# EAGLE design synth-zodiac-libra-vca (EAGLE 9.6.2)
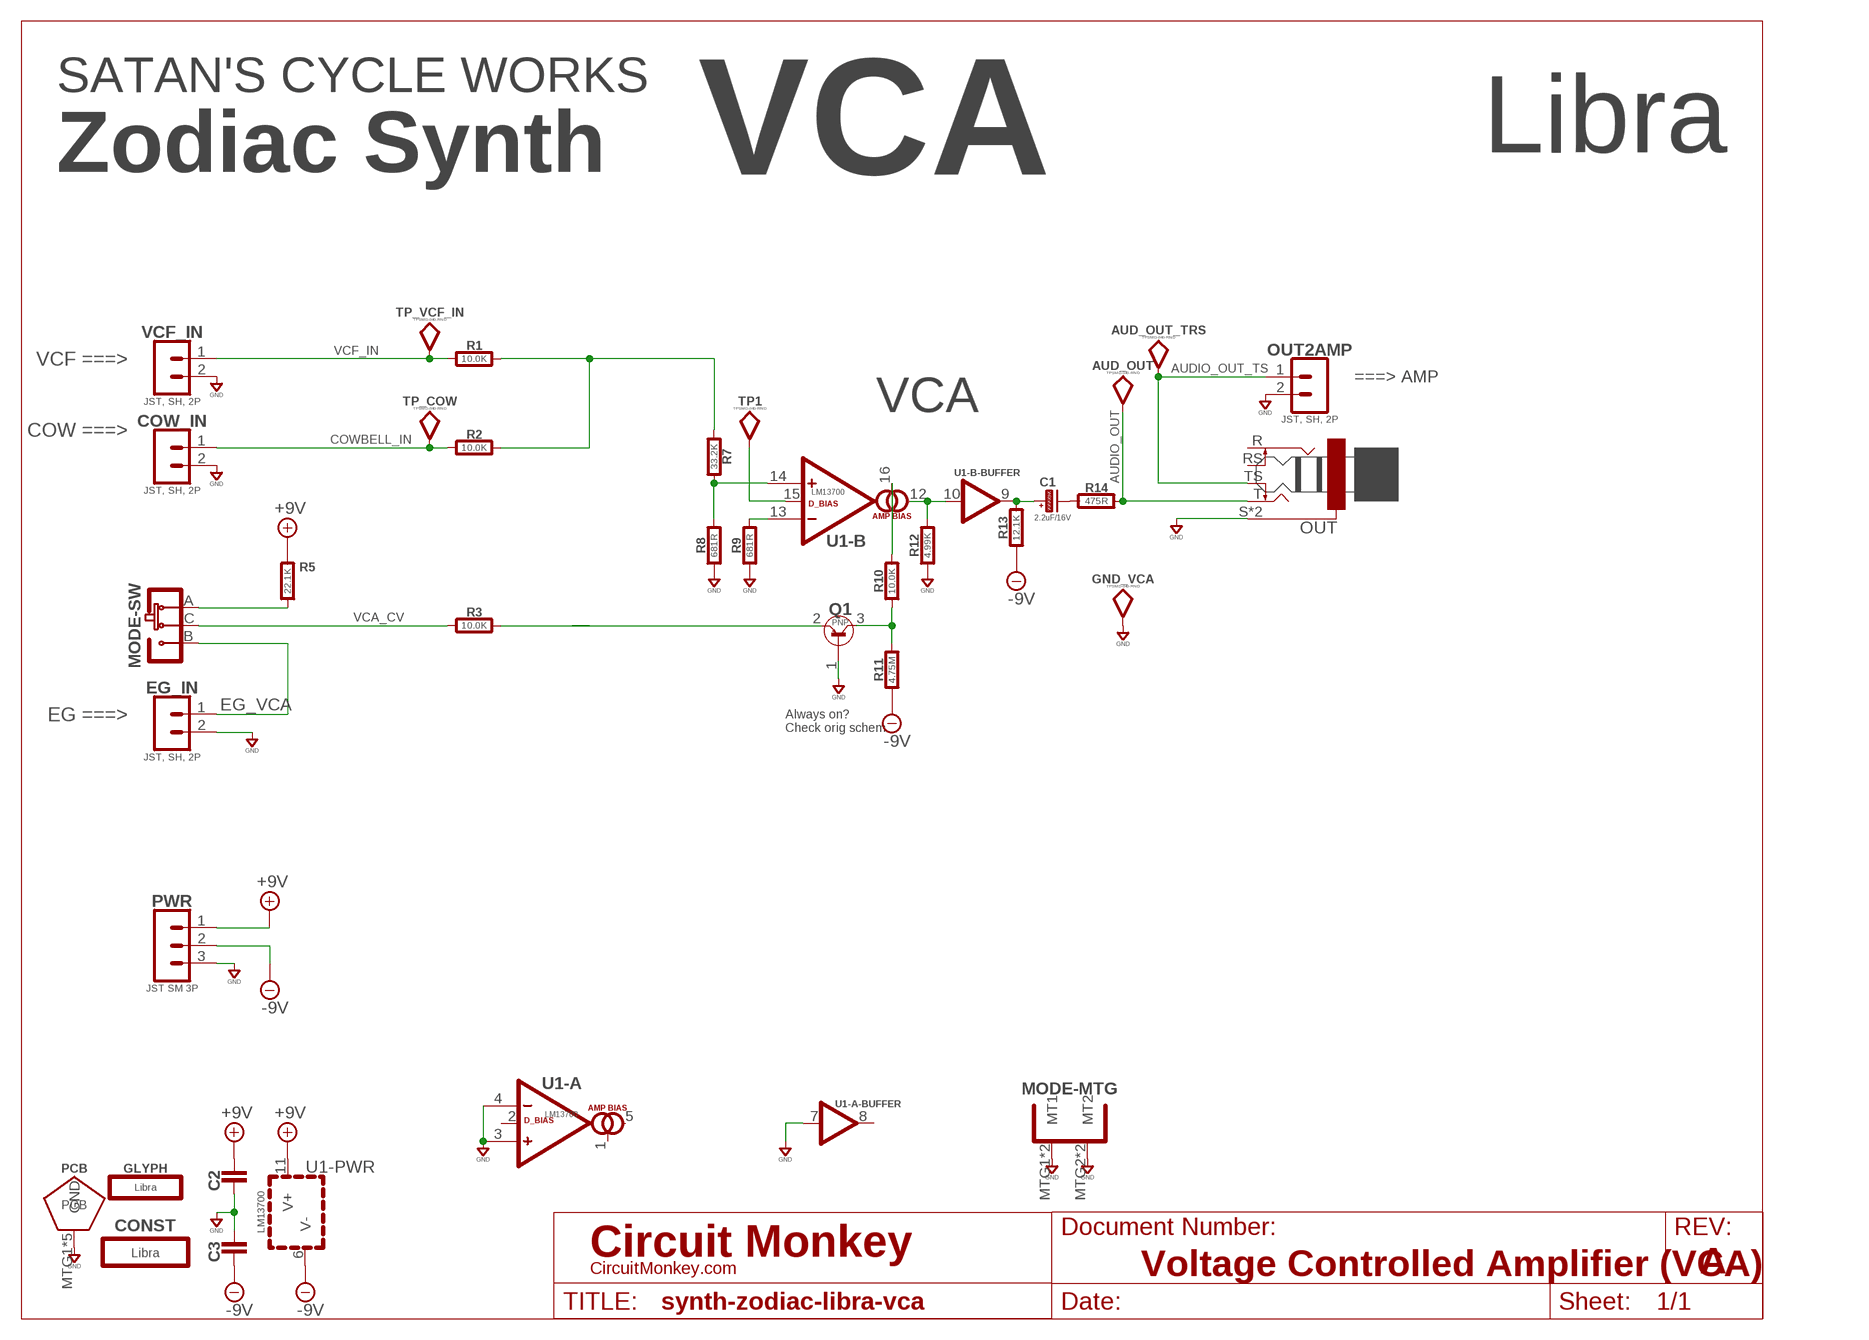
[diagram p0: schematic, sheet 1]
U$1 (LETTER_L-CIRCUITMONKEY): DOCUMENT_NUMBER: Voltage Controlled Amplifier (VCA); REV: A

## Parts
AUD_OUT  TPSMD-040-RND  [SMD-040MIL-RND]
AUD_OUT_TRS  TPSMD-040-RND  [SMD-040MIL-RND]
C1  2.2uF/16V  CAPACITOR_POL-ALUM-SMT-4  [CAP_ALUM_SMT_4]
C2  0.1uF  CAPACITOR0603  [0603-CAP]
C3  0.1uF  CAPACITOR0603  [0603-CAP]
CONST  Libra  CONSTELLATION-LIBRA  [LIBRA-CONST]
COW_IN  JST, SH, 2P  02P-SM-VT-SMT  [BM02B-SRSS-TB]
EG_IN  JST, SH, 2P  02P-SM-VT-SMT  [BM02B-SRSS-TB]
GLYPH  Libra  GLYPH-LIBRA  [LIBRA-GLYPH]
GND_VCA  TPSMD-040-RND  [SMD-040MIL-RND]
MODE  SLIDE-SPDT-MNTSS-12-F45-TH-PCB-2  [SS-12-F45-PNL-SMT-2]
OUT  6.35MM JACK  TRS-JACK-STEREOPCB-PANEL  [PNL-6.35-SMT-PADS]
OUT2AMP  JST, SH, 2P  02P-SM-VT-SMT  [BM02B-SRSS-TB]
PCB  PCB FAB  PENTAGON-40R  [PENTAGON-40MM-RAD]
PWR  JST SM 3P  03P-SM-VT-SMT  [BM03B-SRSS-TB]
Q1  PNP  PNP-BC856  [SOT-23]
R1  10.0K  RESISTOR0603  [0603-RES]
R2  10.0K  RESISTOR0603  [0603-RES]
R3  10.0K  RESISTOR0603  [0603-RES]
R5  22.1K  RESISTOR0603  [0603-RES]
R7  33.2K  RESISTOR0603  [0603-RES]
R8  681R  RESISTOR0603  [0603-RES]
R9  681R  RESISTOR0603  [0603-RES]
R10  10.0K  RESISTOR0603  [0603-RES]
R11  4.75M  RESISTOR0603  [0603-RES]
R12  4.99K  RESISTOR0603  [0603-RES]
R13  12.1K  RESISTOR0603  [0603-RES]
R14  475R  RESISTOR0603  [0603-RES]
TP1  TPSMD-040-RND  [SMD-040MIL-RND]
TP_COW  TPSMD-040-RND  [SMD-040MIL-RND]
TP_VCF_IN  TPSMD-040-RND  [SMD-040MIL-RND]
U1  LM13700  DUAL-BIASLM13700-SMD  [SO16]
VCF_IN  JST, SH, 2P  02P-SM-VT-SMT  [BM02B-SRSS-TB]

## Nets
+9V: C2.2 PWR.1 R5.2 U1.11(-PWR:V+)
-9V: C3.1 PWR.2 R11.1 R13.1 U1.6(-PWR:V-)
AUDIO_OUT: AUD_OUT.TP OUT.T R14.2
AUDIO_OUT_TS: AUD_OUT_TRS.TP OUT2AMP.1 OUT.TS(TN)
COWBELL_IN: COW_IN.1 R2.1 TP_COW.TP
EG_VCA: EG_IN.1 MODE.B(-SW:B)
GND: C2.1 C3.2 COW_IN.2 EG_IN.2 GND_VCA.TP MODE.MTG1(-MTG:MT1) MODE.MTG2(-MTG:MT2) MODE.MTG3(-MTG:MT1) MODE.MTG4(-MTG:MT2) OUT2AMP.2 OUT.S OUT.SS(S) PCB.MTG1(GND) PCB.MTG2(GND) PCB.MTG3(GND) PCB.MTG4(GND) PCB.MTG5(GND) PWR.3 Q1.1(BASE) R8.1 R9.1 R12.1 U1.3(-A:+) U1.4(-A:-) U1.7(-A-BUFFER:IN) VCF_IN.2
N$45: R9.2 U1.13(-B:-)
N$60: R7.2 R8.2 U1.14(-B:+)
N$61: TP1.TP U1.15(-B:DIODE-BIAS)
N$62: R12.2 U1.10(-B-BUFFER:IN) U1.12(-B:OUT)
N$63: R10.2 U1.16(-B:AMP-BIAS)
N$64: C1.POS(P) R13.2 U1.9(-B-BUFFER:OUT)
N$65: C1.NEG(N) R14.1
N$66: Q1.3(COLLECTOR) R10.1 R11.2
N$68: Q1.2(EMITTER) R3.2
N$142: MODE.A(-SW:A) R5.1
VCA_CV: MODE.C(-SW:C) R3.1
VCF_IN: R1.1 TP_VCF_IN.TP VCF_IN.1
VCF_OUT: R1.2 R2.2 R7.1
Unconnected: OUT.R OUT.RS(RN) U1.1(-A:AMP-BIAS) U1.2(-A:DIODE-BIAS) U1.5(-A:OUT) U1.8(-A-BUFFER:OUT)

## Notes on the sheet
- VCA | Libra
- SATAN'S CYCLE WORKS
- Zodiac Synth
- VCF ===>
- ===> AMP
- VCA
- COW ===>
- EG ===>
- Always on?  
  Check orig schem.

## Library data of the parts
AUD_OUT AUD_OUT_TRS GND_VCA TP1 TP_COW TP_VCF_IN = con-testpoints:TP: Test Point -- Testpoint
C1 = rlc:CAPACITOR_POL: Polarized Capacitor
C2 C3 = rlc:CAPACITOR: Capacitor; COST01: 0.12; COST10: 0.09; COST100: 0.05
CONST = circuit-monkey-zodiac:CONSTELLATION: Constellations
COW_IN EG_IN OUT2AMP VCF_IN = con-jst:02P: 2 pin connector; COST01: 0.45; COST10: 0.4; COST100: 0.35; MFR: JST; MPN: BMB02B-SRSS-TB
GLYPH = circuit-monkey-zodiac:GLYPH: Glyph
MODE = switch-thd:SLIDE-SPDT-MNT: Slide Switch, SPDT; COST01: 0.15; COST10: 0.12; COST100: 0.12; MFR: Tayda; MPN: A-659/A-5111/A-5104
OUT = con-trs:TRS-JACK-STEREO: TRS Jack
PCB = circuit-monkey-zodiac:PENTAGON: Pentagram shaped PCB
PWR = con-jst:03P: 3 pin connector; COST01: 0.60; COST10: 0.45; COST100: 0.38; MFR: JST; MPN: BM03B-SRSS-TB
Q1 = transistor-bjt:PNP: PNP BJ Transistor; MFR: On Semiconductor; MOUSER: https://www.mouser.com/ProductDetail/ON-Semiconductor/BC856BLT1G; MPN: BC856
R1-R3 R5 R7-R14 = rlc:RESISTOR: Resistor; COST01: 0.10; COST10: 0.05; COST100: 0.02
U1 = op-amp:DUAL-BIAS: Op Amp with Bias controls; COST01: 1.70; COST10: 1.60; COST100: 1.50; MFR: TI; MPN: LM13700M

## Board
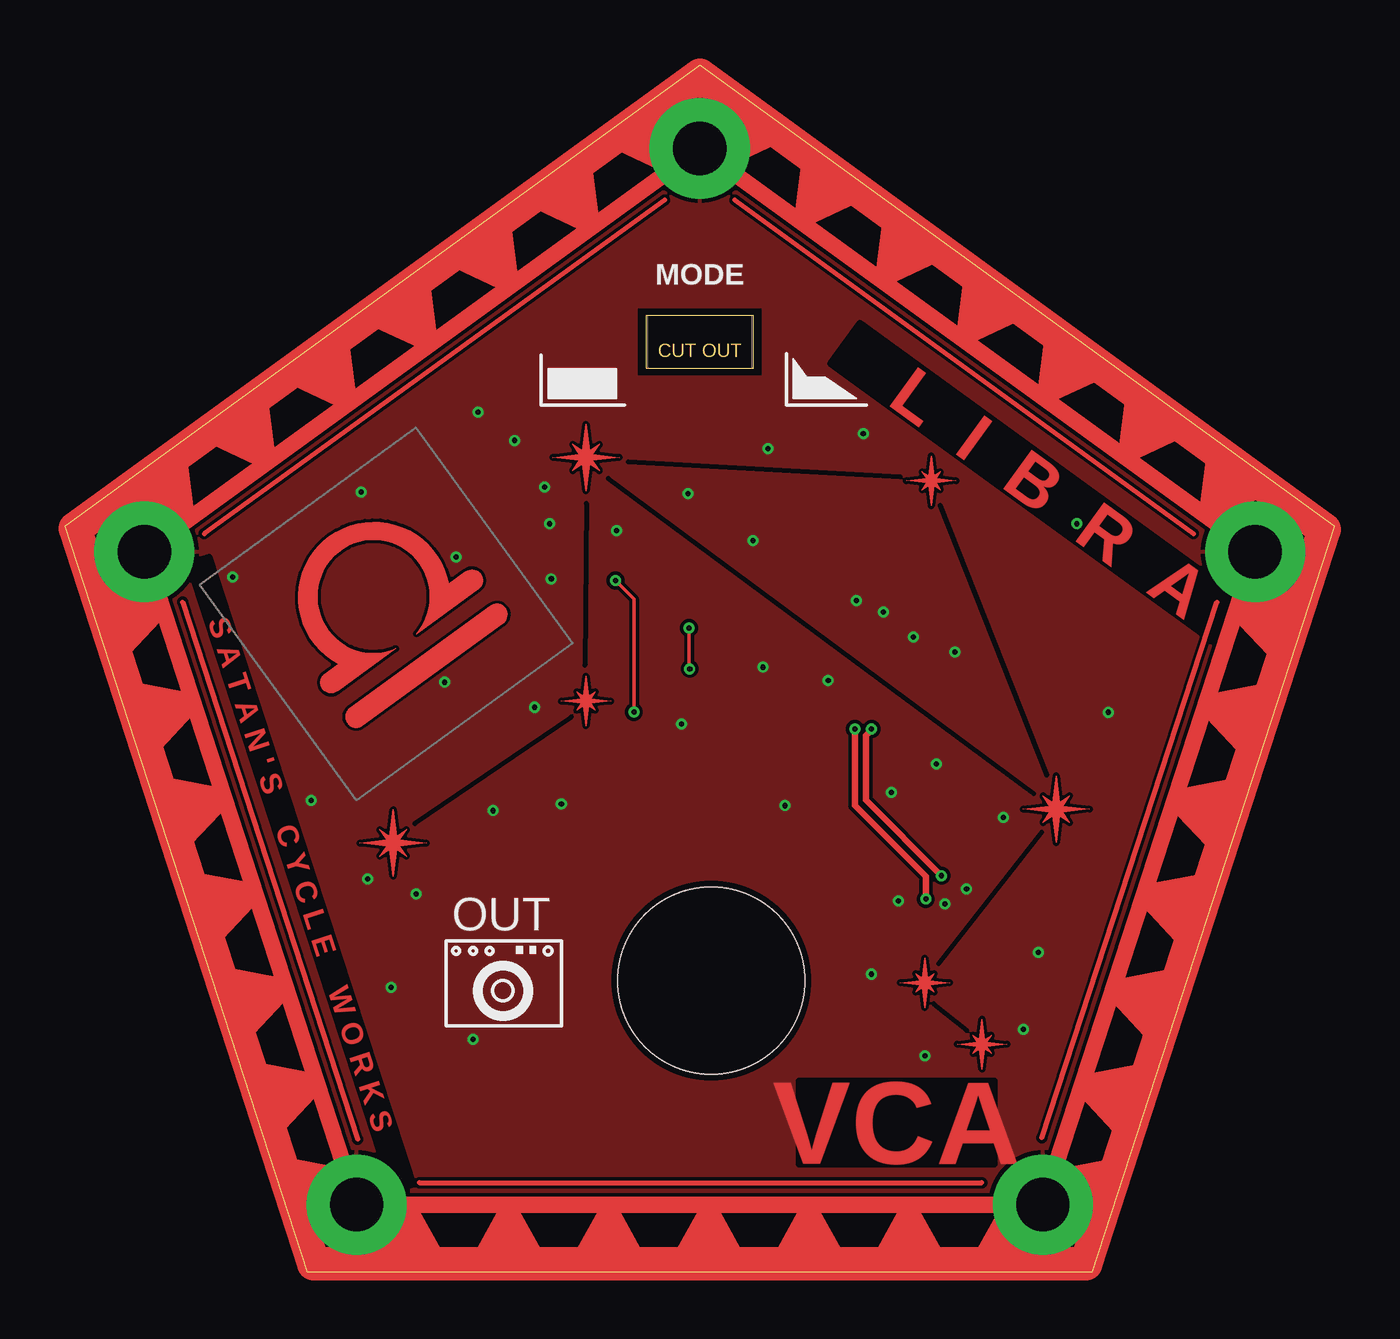
[diagram p1: board, top side]
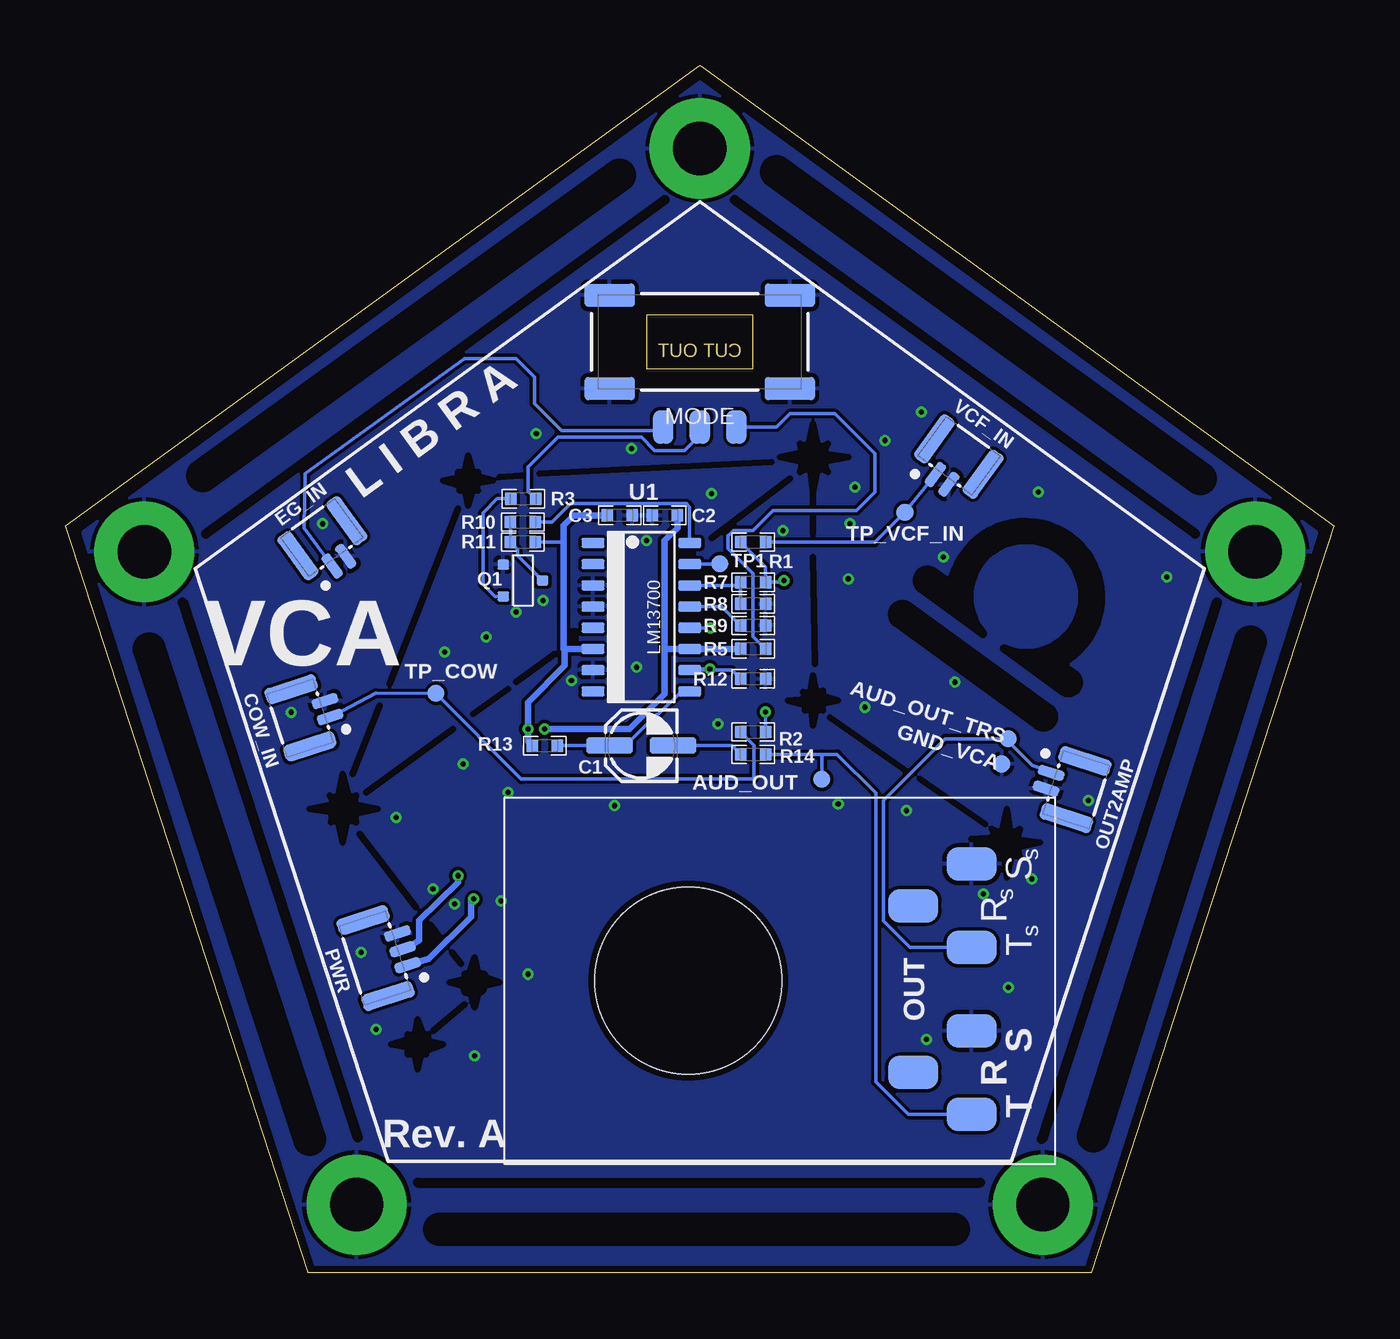
[diagram p2: board, bottom side, seen from below]

Size 76.08 x 72.36 mm. Coordinates in mm from the lower left corner, seen from the top.
Copper layers (1*16): Top 0.0356mm / dielectric 1.5011mm / Bottom 0.0356mm
Design rules "OSH-CircuitMonkey *": minimum track width 6mil, minimum drill 12mil, track to track 0.2mm, track to pad 0.2mm, pad to pad 0.2mm, via to via 0.2mm, smd to smd 0.15mm, copper to edge 15mil, drill to drill 6mil, minimum pad ring 7mil, minimum via ring 7mil, stop-mask expansion 3mil, vias tented up to drill 12mil, thermal gap 10mil
bRestrict: area 53.4,12.2 to 56.5,15.2; area 50,15.9 to 53,18.9; area 57.3,25.8 to 61.4,29.9; area 50.4,46 to 53.4,49; area 29.1,46.8 to 33.2,50.9; area 29.7,32.8 to 32.7,35.8; area 17.6,23.7 to 21.7,27.8; 19 lines

### Footprints (pad centres in the part's own frame; a part is rotated, then mirrored left to right if it is on the bottom)
SMD-040MIL-RND = smd 1.016 x 1.016: TP 0,0
CAP_ALUM_SMT_4 = smd 2.8 x 1: NEG -1.9,0; POS 1.9,0
0603-CAP = smd 0.711 x 0.762: 1 -0.752,0; 2 0.752,0
BM02B-SRSS-TB = smd 0.6 x 1.6: 1 -0.5,-0.3; 2 0.5,-0.3 | smd 1 x 3.2: MTG1 1.8,1.4; MTG2 -1.8,1.4
SS-12-F45-PNL-SMT-2 = smd 1.2 x 2 bottom: A -2.2,-5.1; B 2.2,-5.1; C 0,-5.1 | smd 3 x 1.4 bottom: MTG1 -5.4,2.8; MTG2 5.4,2.8; MTG3 -5.4,-2.8; MTG4 5.4,-2.8
PNL-6.35-SMT-PADS = smd 2 x 3: R -5.5,-13.5; RS 4.5,-13.5; S -3,-17; SS 7,-17; T -8,-17; TS 2,-17 | hole 11.2: 0,0
PENTAGON-40MM-RAD = drill 3.2 pad 6: MTG1 0,35; MTG2 33.3,10.82; MTG3 20.57,-28.32; MTG4 -20.57,-28.32; MTG5 -33.3,10.82
BM03B-SRSS-TB = smd 0.6 x 1.6: 1 -1,-0.3; 2 0,-0.3; 3 1,-0.3 | smd 1 x 3.2: MTG1 2.4,1.4; MTG2 -2.4,1.4
SOT-23 = smd 0.6 x 0.7: 1 -0.95,-1.18; 2 0.95,-1.18; 3 0,1.18
0603-RES = smd 0.711 x 0.762: 1 -0.752,0; 2 0.752,0
SO16 = smd 0.6 x 1.4: 1 -4.445,-2.9; 2 -3.175,-2.9; 3 -1.905,-2.9; 4 -0.635,-2.9; 5 0.635,-2.9; 6 1.905,-2.9; 7 3.175,-2.9; 8 4.445,-2.9; 9 4.445,2.9; 10 3.175,2.9; 11 1.905,2.9; 12 0.635,2.9; 13 -0.635,2.9; 14 -1.905,2.9; 15 -3.175,2.9; 16 -4.445,2.9

### Placement (x,y rotation side)
AUD_OUT  30.72,29.54 180 bottom
AUD_OUT_TRS  19.54,31.96 180 bottom
C1  41.54,31.56 180 bottom
C2  40.14,45.36 0 bottom
C3  42.84,45.36 0 bottom
CONST  42.14,32.96 0 top
COW_IN  60.64,33.66 108 bottom
EG_IN  59.84,42.86 36 bottom
GLYPH  19.24,39.46 36 top
GND_VCA  19.94,30.46 180 bottom
MODE  38.04,55.76 0 top
OUT  38.74,17.46 90 bottom
OUT2AMP  16.84,29.36 252 bottom
PCB  38.04,32.36 0 top
PWR  56.14,19.26 108 bottom
Q1  48.64,41.46 270 bottom
R1  34.84,43.76 180 bottom
R2  34.84,32.38 0 bottom
R3  48.63,46.36 180 bottom
R5  34.84,37.36 180 bottom
R7  34.84,41.36 180 bottom
R8  34.84,40.06 180 bottom
R9  34.84,38.76 180 bottom
R10  48.64,44.96 0 bottom
R11  48.64,43.76 180 bottom
R12  34.84,35.56 180 bottom
R13  47.34,31.56 0 bottom
R14  34.84,31.03 0 bottom
TP1  36.84,42.46 0 bottom
TP_COW  53.86,34.7 180 bottom
TP_VCF_IN  25.74,45.56 180 bottom
U1  41.54,39.26 270 bottom
VCF_IN  23.34,47.76 324 bottom

### Tracks (layer width: path | path; a pad name or v marks a point on that pad's centre or on a via)
+9V  (via drill 0.3)
  Top 0.4: v51.59,22.36 51.59,23.71 47.34,27.96 v47.34,32.56
  Bottom 0.2: R5.2
  Bottom 0.4: R5.2 U1.11 40.14,37.36 | C2.2 39.39,44.61 40.14,43.86 40.14,37.36 | 40.14,37.36 40.14,34.67 42.25,32.56 v47.34,32.56 | v51.59,22.36 51.75,22.21 51.75,21.3 54.3,18.77 PWR.1
-9V  (via drill 0.3)
  Top 0.4: v48.34,32.56 48.34,32.49 48.01,32.16 48.01,28.29 v52.54,23.76
  Bottom 0.2: R11.1 46.19,43.76
  Bottom 0.4: C3.1 45.59,45.36 46.19,44.76 46.19,43.76 46.19,37.36 U1.6 46.15,37.36 46.14,36.36 48.34,34.16 v48.34,32.56 48.34,31.81 R13.1 | v52.54,23.76 52.54,23.36 54.86,21.07 54.87,19.89 55.71,19.35 PWR.2
AUDIO_OUT
  Bottom 0.2: AUD_OUT.TP 30.72,31.03 R14.2 29.81,31.03 27.49,28.71 27.49,11.41 25.54,9.46 OUT.T
AUDIO_OUT_TS
  Bottom 0.2: OUT.TS 25.44,19.46 27.04,21.06 27.04,28.26 23.34,31.96 AUD_OUT_TRS.TP 19.54,31.81 18.09,30.36 16.97,29.99 OUT2AMP.1
COWBELL_IN
  Bottom 0.2: R2.1 34.79,31.58 34.79,29.56 48.74,29.56 53.86,34.68 TP_COW.TP 57.45,34.7 59.99,33.38 59.99,33.37 COW_IN.1
EG_VCA
  Bottom 0.2: EG_IN.1 61.75,44.62 61.7,47.86 52.13,54.76 49.04,54.76 47.94,53.66 47.94,52.06 46.34,50.46 40.44,50.46 MODE.B
GND  (via drill 0.3)
  other vias: 47.44,40.26 29.04,44.86 26.94,49.86 42.14,49.36 47.84,50.26 49.04,39.56 53.34,37.16 56.24,27.26 49.54,28.76 43.14,27.96 45.74,35.46 50.84,38.06 41.84,36.26 41.24,43.86 10.04,41.66 28.14,33.86 29.14,41.56 24.74,51.56 22.74,35.36 29.74,28.06 21.04,22.66 18.14,23.56 14.74,28.26 54.04,22.96 48.34,17.86 51.54,12.96 49.94,22.26 52.24,30.46 33.04,44.46 62.54,33.56 24.44,13.96 19.54,17.06 23.44,42.86 17.74,46.76 25.64,27.66 36.94,32.86 37.34,46.66 60.64,44.86 57.44,14.56 58.34,19.16 52.74,22.06 28.74,47.06
  pour Bottom (rank 5): 15.04,0.36 61.04,0.36 75.04,44.36 38.04,71.36 1.04,44.36
  pour Top (rank 4): 17.34,3.86 58.74,3.86 71.64,43.26 38.04,67.66 4.54,43.26
N$45
  Bottom 0.2: U1.13 36.73,39.9 R9.2
N$60
  Bottom 0.2: U1.14 35.4,41.17 R7.2 R8.2
N$61
  Bottom 0.2: U1.15 36.87,42.44 TP1.TP
N$62  (via drill 0.3)
  Top 0.2: v37.44,36.16 37.4,36.2 v37.4,38.61
  Bottom 0.2: R12.2 36.12,36.09 U1.10 38.57,36.16 v37.44,36.16 | v37.4,38.61 38.62,38.61 U1.12
N$63
  Bottom 0.2: R10.2 46.89,44.96 45.79,46.06 38.84,46.06 38.64,45.86 U1.16
N$64
  Bottom 0.2: U1.9 39.14,34.82 40.54,33.42 40.64,33.42 42.5,31.56 C1.POS R13.2
N$65
  Bottom 0.2: R14.1 36.12,31.56 C1.NEG
N$66
  Bottom 0.2: R10.1 R11.2 48.96,43.33 48.96,42.96 Q1.3
N$68
  Bottom 0.2: R3.2 50.18,46.36 51.04,45.5 51.04,41.23 50.32,40.51 Q1.2
N$142
  Bottom 0.2: R5.1 34.11,37.36 34.85,38.1 34.85,41.86 36.34,43.36 36.34,44.16 36.31,44.16 36.03,44.44 34.86,44.44 33.64,45.66 28.64,45.66 27.54,46.76 27.54,49.06 29.94,51.46 32.64,51.46 33.44,50.66 MODE.A
VCA_CV
  Bottom 0.2: R3.1 48.34,46.82 48.34,48.27 46.54,50.06 41.54,50.06 40.74,49.26 38.94,49.26 38.14,50.06 38.14,50.56 MODE.C
VCF_IN
  Bottom 0.2: R1.1 27.54,43.76 TP_VCF_IN.TP 25.74,45.57 VCF_IN.1
VCF_OUT  (via drill 0.3)
  Top 0.2: v32.99,41.46 34.09,40.36 v34.09,33.57
  Bottom 0.2: R1.2 34.09,42.26 R7.1 33.09,41.36 v32.99,41.46 | R2.2 v34.1,33.57 v34.09,33.57

### Text on the board
Top: L I B R A | S A T A N ' S C Y C L E W O R K S | VCA
tPlace: OUT
bPlace: L I B R A | VCA | Rev. A
tStop: L I B R A | S A T A N ' S C Y C L E W O R K S | VCA